# EAGLE design ftduino (EAGLE 7.5.0)
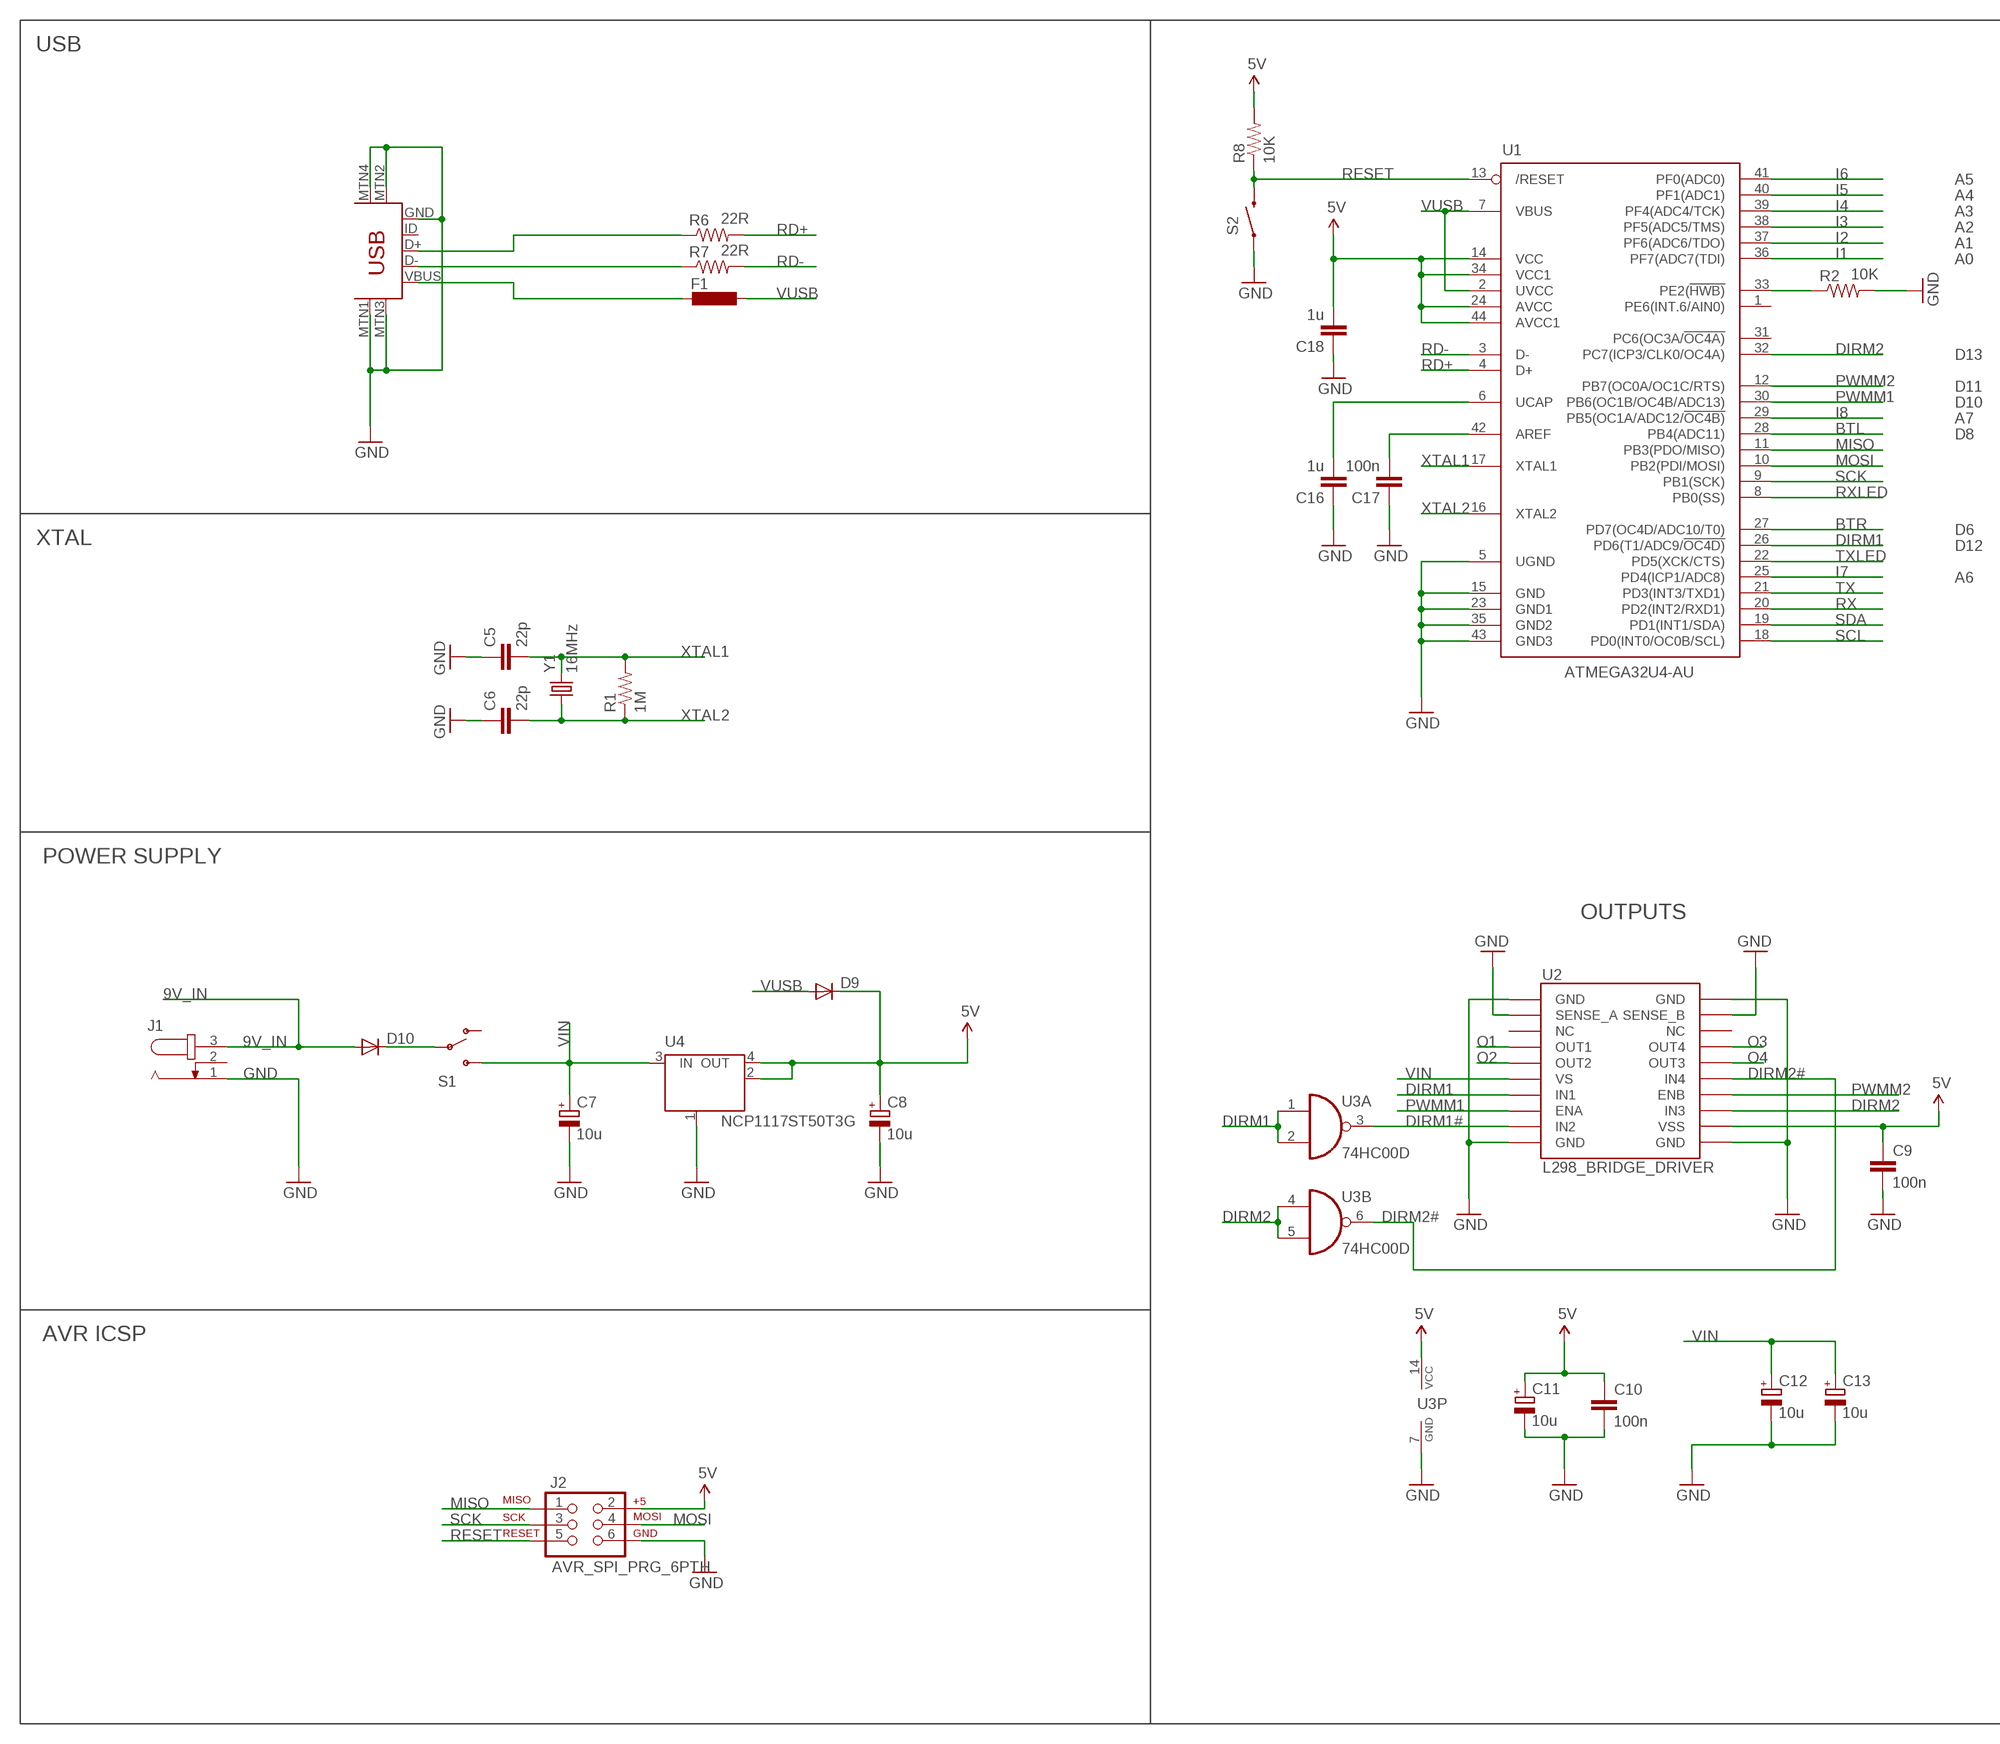
[diagram p0: schematic, sheet 1, part 1 of 2]
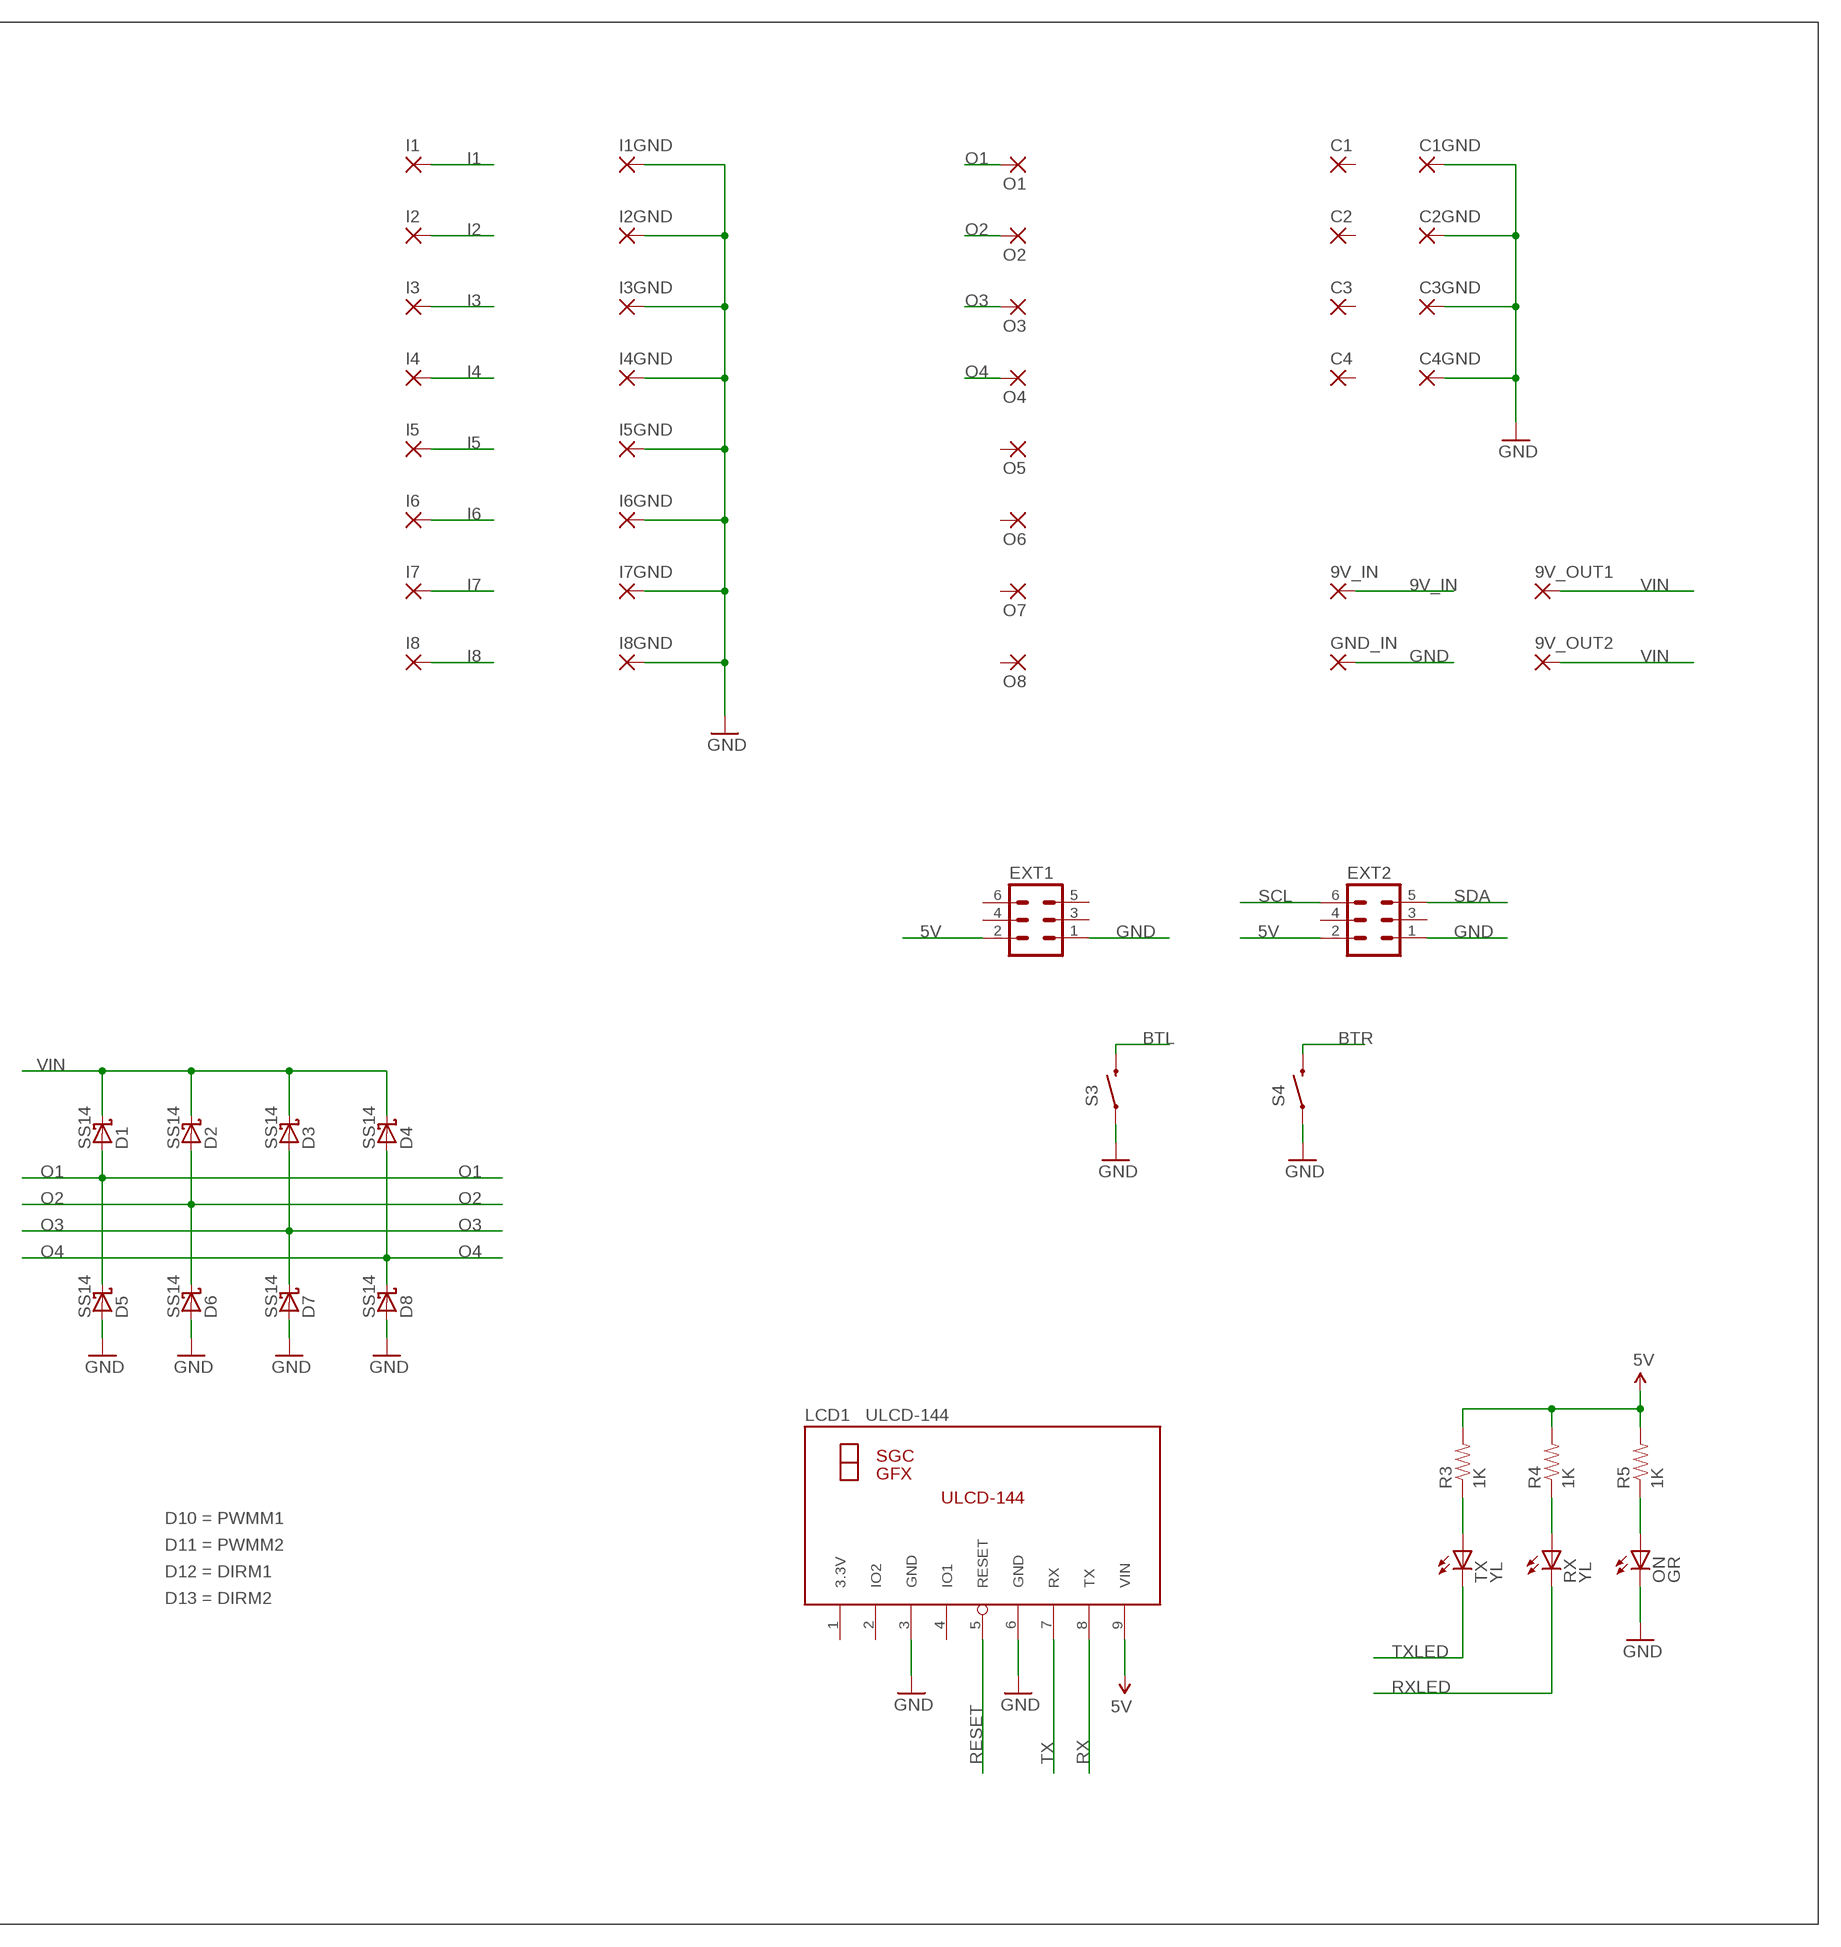
[diagram p1: schematic, sheet 1, part 2 of 2]

## Parts
9V_IN  5,0/3,2  [5,0/3,2]
9V_OUT1  5,0/3,2  [5,0/3,2]
9V_OUT2  5,0/3,2  [5,0/3,2]
C1  5,0/3,2  [5,0/3,2]
C1GND  5,0/3,2  [5,0/3,2]
C2  5,0/3,2  [5,0/3,2]
C2GND  5,0/3,2  [5,0/3,2]
C3  5,0/3,2  [5,0/3,2]
C3GND  5,0/3,2  [5,0/3,2]
C4  5,0/3,2  [5,0/3,2]
C4GND  5,0/3,2  [5,0/3,2]
C5  22p  CAP0603-CAP  [0603-CAP]
C6  22p  CAP0603-CAP  [0603-CAP]
C7  10u  CPOL-EUSMCB  [SMC_B]
C8  10u  CPOL-EUSMCB  [SMC_B]
C9  100n  CAP0603-CAP  [0603-CAP]
C10  100n  CAP0603-CAP  [0603-CAP]
C11  10u  CPOL-EUSMCB  [SMC_B]
C12  10u  CPOL-EUSMCB  [SMC_B]
C13  10u  CPOL-EUSMCB  [SMC_B]
C16  1u  CAP0603-CAP  [0603-CAP]
C17  100n  CAP0603-CAP  [0603-CAP]
C18  1u  CAP0603-CAP  [0603-CAP]
D1  SS14  SCHOTTKY-DIODE  [SMA]
D2  SS14  SCHOTTKY-DIODE  [SMA]
D3  SS14  SCHOTTKY-DIODE  [SMA]
D4  SS14  SCHOTTKY-DIODE  [SMA]
D5  SS14  SCHOTTKY-DIODE  [SMA]
D6  SS14  SCHOTTKY-DIODE  [SMA]
D7  SS14  SCHOTTKY-DIODE  [SMA]
D8  SS14  SCHOTTKY-DIODE  [SMA]
D9  DIODE-SMB  [SMB]
D10  DIODE-SMB  [SMB]
EXT1  MA03-2  [MA03-2]
EXT2  MA03-2  [MA03-2]
F1  L-EUL1812  [L1812]
GND_IN  5,0/3,2  [5,0/3,2]
I1  5,0/3,2  [5,0/3,2]
I1GND  5,0/3,2  [5,0/3,2]
I2  5,0/3,2  [5,0/3,2]
I2GND  5,0/3,2  [5,0/3,2]
I3  5,0/3,2  [5,0/3,2]
I3GND  5,0/3,2  [5,0/3,2]
I4  5,0/3,2  [5,0/3,2]
I4GND  5,0/3,2  [5,0/3,2]
I5  5,0/3,2  [5,0/3,2]
I5GND  5,0/3,2  [5,0/3,2]
I6  5,0/3,2  [5,0/3,2]
I6GND  5,0/3,2  [5,0/3,2]
I7  5,0/3,2  [5,0/3,2]
I7GND  5,0/3,2  [5,0/3,2]
I8  5,0/3,2  [5,0/3,2]
I8GND  5,0/3,2  [5,0/3,2]
J1  JACK-PLUG1  [JK3.5/1.8]
J2  AVR_SPI_PRG_6PTH  [2X3]
LCD1  ULCD-144  [ULCD-144]
O1  5,0/3,2  [5,0/3,2]
O2  5,0/3,2  [5,0/3,2]
O3  5,0/3,2  [5,0/3,2]
O4  5,0/3,2  [5,0/3,2]
O5  5,0/3,2  [5,0/3,2]
O6  5,0/3,2  [5,0/3,2]
O7  5,0/3,2  [5,0/3,2]
O8  5,0/3,2  [5,0/3,2]
ON  GR  LEDCHIPLED_0805  [CHIPLED_0805]
R1  1M  RESISTOR0603-RES  [0603-RES]
R2  10K  RESISTOR0603-RES  [0603-RES]
R3  1K  RESISTOR0603-RES  [0603-RES]
R4  1K  RESISTOR0603-RES  [0603-RES]
R5  1K  RESISTOR0603-RES  [0603-RES]
R6  22R  RESISTOR0603-RES  [0603-RES]
R7  22R  RESISTOR0603-RES  [0603-RES]
R8  10K  RESISTOR0603-RES  [0603-RES]
RX  YL  LEDCHIPLED_0805  [CHIPLED_0805]
S1  SWITCH-SPSTPTH  [SWITCH-SPDT]
S2  SWITCH-MOMENTARY-2PTH  [TACTILE-PTH]
S3  SWITCH-MOMENTARY-2PTH  [TACTILE-PTH]
S4  SWITCH-MOMENTARY-2PTH  [TACTILE-PTH]
TX  YL  LEDCHIPLED_0805  [CHIPLED_0805]
U1  ATMEGA32U4-AU  [TQFP44]
U2  L298_BRIDGE_DRIVER  [POWERSO20]
U3  74HC00D  [SO14]
U4  NCP1117ST50T3G  MC33269ST-3.3T3  [SOT223]
X1  USB-MINIB-5PIN  [USB-MINIB]
Y1  16MHz  CRYSTALCTS406  [CTS406]

## Nets
5V: C8.+ C9.1 C10.1 C11.+ C18.2 D9.C EXT1.2 EXT2.2 J2.2 LCD1.9(VIN) R3.2 R4.2 R5.2 R8.2 U1.14(VCC) U1.24(AVCC) U1.34(VCC1) U1.44(AVCC1) U2.12(VSS) U3.14(P:VCC) U4.2(OUT) U4.4(OUT)
9V_IN: 9V_IN.1(P) D10.A J1.3
BTL: S3.3 U1.28(PB4(ADC11))
BTR: S4.3 U1.27(PD7(OC4D/ADC10/T0))
DIRM1: U1.26(PD6(T1/ADC9/!OC4D)) U2.7(IN1) U3.1(A:I0) U3.2(A:I1)
DIRM1#: U2.9(IN2) U3.3(A:O)
DIRM2: U1.32(PC7(ICP3/CLK0/OC4A)) U2.13(IN3) U3.4(B:I0) U3.5(B:I1)
DIRM2#: U2.15(IN4) U3.6(B:O)
GND: C1GND.1(P) C2GND.1(P) C3GND.1(P) C4GND.1(P) C5.1 C6.1 C7.- C8.- C9.2 C10.2 C11.- C12.- C13.- C16.1 C17.1 C18.1 D5.A D6.A D7.A D8.A EXT1.1 EXT2.1 GND_IN.1(P) I1GND.1(P) I2GND.1(P) I3GND.1(P) I4GND.1(P) I5GND.1(P) I6GND.1(P) I7GND.1(P) I8GND.1(P) J1.1 J2.6 LCD1.3(GND) LCD1.6(GND) ON.C R2.2 S2.1 S3.1 S4.1 U1.5(UGND) U1.15(GND) U1.23(GND1) U1.35(GND2) U1.43(GND3) U2.1(GND) U2.2(SENSE_A) U2.10(GND) U2.11(GND) U2.19(SENSE_B) U2.20(GND) U3.7(P:GND) U4.1(GND/ADJ) X1.GND X1.MTN1(MTN2) X1.MTN2(MTN3) X1.MTN3(MTN1) X1.MTN4
I1: I1.1(P) U1.36(PF7(ADC7(TDI))
I2: I2.1(P) U1.37(PF6(ADC6/TDO))
I3: I3.1(P) U1.38(PF5(ADC5/TMS))
I4: I4.1(P) U1.39(PF4(ADC4/TCK))
I5: I5.1(P) U1.40(PF1(ADC1))
I6: I6.1(P) U1.41(PF0(ADC0))
I7: I7.1(P) U1.25(PD4(ICP1/ADC8))
I8: I8.1(P) U1.29(PB5(OC1A/ADC12/!OC4B))
MISO: J2.1 U1.11(PB3(PDO/MISO))
MOSI: J2.4 U1.10(PB2(PDI/MOSI))
N$1: C17.2 U1.42(AREF)
N$2: C16.2 U1.6(UCAP)
N$3: R3.1 TX.A
N$4: R4.1 RX.A
N$5: ON.A R5.1
N$6: R6.1 X1.D+
N$7: R7.1 X1.D-
N$8: R2.1 U1.33(PE2(!HWB))
N$9: F1.2 X1.VBUS
N$12: D10.C S1.2(P)
O1: D1.A D5.C O1.1(P) U2.4(OUT1)
O2: D2.A D6.C O2.1(P) U2.5(OUT2)
O3: D3.A D7.C O3.1(P) U2.17(OUT4)
O4: D4.A D8.C O4.1(P) U2.16(OUT3)
PWMM1: U1.30(PB6(OC1B/OC4B/ADC13)) U2.8(ENA)
PWMM2: U1.12(PB7(OC0A/OC1C/RTS)) U2.14(ENB)
RD+: R6.2 U1.4(D+)
RD-: R7.2 U1.3(D-)
RESET: J2.5 LCD1.5(RESET) R8.1 S2.3 U1.13(/RESET)
RX: LCD1.8(TX) U1.20(PD2(INT2/RXD1))
RXLED: RX.C U1.8(PB0(SS))
SCK: J2.3 U1.9(PB1(SCK))
SCL: EXT2.6 U1.18(PD0(INT0/OC0B/SCL))
SDA: EXT2.5 U1.19(PD1(INT1/SDA))
TX: LCD1.7(RX) U1.21(PD3(INT3/TXD1))
TXLED: TX.C U1.22(PD5(XCK/CTS))
VIN: 9V_OUT1.1(P) 9V_OUT2.1(P) C7.+ C12.+ C13.+ D1.C D2.C D3.C D4.C S1.3(S) U2.6(VS) U4.3(IN)
VUSB: D9.A F1.1 U1.2(UVCC) U1.7(VBUS)
XTAL1: C5.2 R1.2 U1.17(XTAL1) Y1.3
XTAL2: C6.2 R1.1 U1.16(XTAL2) Y1.1
Unconnected: C1.1(P) C2.1(P) C3.1(P) C4.1(P) EXT1.3 EXT1.4 EXT1.5 EXT1.6 EXT2.3 EXT2.4 J1.2 LCD1.2(IO2) LCD1.4(IO1) O5.1(P) O6.1(P) O7.1(P) O8.1(P) S1.1(O) U1.1(PE6(INT.6/AIN0)) U1.31(PC6(OC3A/!OC4A)) U2.3(NC) U2.18(NC) U3.8(C:O) U3.9(C:I0) U3.10(C:I1) U3.11(D:O) U3.12(D:I0) U3.13(D:I1) X1.ID

## Notes on the sheet
- USB
- A5
- A4
- A3
- A2
- A1
- A0
- D13
- D11
- D10
- A7
- D8
- D6
- XTAL | D12
- A6
- POWER SUPPLY
- OUTPUTS
- AVR ICSP
- D10 = PWMM1
- D11 = PWMM2
- D12 = DIRM1
- D13 = DIRM2

## Power pins joined to a net without a drawn wire
3.3V: LCD1.1(3.3V)

## Library data of the parts
9V_IN 9V_OUT1 9V_OUT2 C1 C1GND C2 C2GND C3 C3GND C4 C4GND GND_IN I1 I1GND I2 I2GND I3 I3GND I4 I4GND I5 I5GND I6 I6GND I7 I7GND I8 I8GND O1-O8 = pacpac:5,0/3,2: THROUGH-HOLE PAD
C5 C6 C9 C10 C16-C18 = SparkFun:CAP: Capacitor Standard 0603 ceramic capacitor, and 0.1" leaded capacitor.
C7 C8 C11-C13 = rcl:CPOL-EU: POLARIZED CAPACITOR, European symbol
D1-D8 = pacpac:SCHOTTKY-DIODE: Schottky Diode
D9 D10 = diode:DIODE-: DIODE
EXT1 EXT2 = con-lstb:MA03-2: PIN HEADER; OC_FARNELL: unknown; OC_NEWARK: unknown
F1 = rcl:L-EU: INDUCTOR, European symbol
J1 = pacpac:JACK-PLUG: DC POWER JACK Power Jack, DC, Right Angle, Through Hole, Rated 5A at 16VDC, PC Terminals Distributor: Farnell (www.Farnell.de) Drawing: 84N1161.pdf / 84N1162.pdf Manufacturer: SPC Technology (www.spctechnology.com) Type: SPC4077 / SPC 4078; OC_FARNELL: unknown; OC_NEWARK: unknown
J2 = SparkFun:AVR_SPI_PRG_6: AVR ISP 6 Pin This is the reduced ISP connector for AVR programming. Common on Arduino. This footprint will take up less PCB space and can be used with a 10-pin to 6-pin adapter such as SKU: BOB-08508
LCD1 = pacpac:ULCD-144
ON RX TX = led:LED: LED OSRAM: - CHIPLED LG R971, LG N971, LY N971, LG Q971, LY Q971, LO R971, LY R971 LH N974, LH R974 LS Q976, LO Q976, LY Q976 LO Q996 - Hyper CHIPLED LW Q18S LB Q993, LB Q99A, LB R99A - SideLED LS A670, LO A670, LY A670, LG A670, LP A670 LB A673, LV A673, LT A673, LW A673 LH A674 LY A675 LS A676, LA A676, LO A676, LY A676, LW A676 LS A679, LY A679, LG A679 - Hyper Micro SIDELED® LS Y876, LA Y876, LO Y876, LY Y876 LT Y87S - SmartLED LW L88C, LW L88S LB L89C, LB L89S, LG L890 LS L89K, LO L89K, LY L89K LS L896, LA L896, LO L896, LY L896 - TOPLED LS T670, LO T670, LY T670, LG T670, LP T670 LSG T670, LSP T670, LSY T670, LOP T670, LYG T670 LG T671, LOG T671, LSG T671 LB T673, LV T673, LT T673, LW T673 LH T674 LS T676, LA T676, LO T676, LY T676, LB T676, LH T676, LSB T676, LW T676 LB T67C, LV T67C, LT T67C, LS T67K, LO T67K, LY T67K, LW E67C LS E67B, LA E67B, LO E67B, LY E67B, LB E67C, LV E67C, LT E67C LW T67C LS T679, LY T679, LG T679 LS T770, LO T770, LY T770, LG T770, LP T770 LB T773, LV T773, LT T773, LW T773 LH T774 LS E675, LA E675, LY E675, LS T675 LS T776, LA T776, LO T776, LY T776, LB T776 LHGB T686 LT T68C, LB T68C - Hyper Mini TOPLED® LB M676 - Mini TOPLED Santana® LG M470 LS M47K, LO M47K, LY M47K Source: http://www.osram.convergy.de LUXEON: - LUMILED® LXK2-PW12-R00, LXK2-PW12-S00, LXK2-PW14-U00, LXK2-PW14-V00 LXK2-PM12-R00, LXK2-PM12-S00, LXK2-PM14-U00 LXK2-PE12-Q00, LXK2-PE12-R00, LXK2-PE12-S00, LXK2-PE14-T00, LXK2-PE14-U00 LXK2-PB12-K00, LXK2-PB12-L00, LXK2-PB12-M00, LXK2-PB14-N00, LXK2-PB14-P00, LXK2-PB14-Q00 LXK2-PR12-L00, LXK2-PR12-M00, LXK2-PR14-Q00, LXK2-PR14-R00 LXK2-PD12-Q00, LXK2-PD12-R00, LXK2-PD12-S00 LXK2-PH12-R00, LXK2-PH12-S00 LXK2-PL12-P00, LXK2-PL12-Q00, LXK2-PL12-R00 Source: www.luxeon.com KINGBRIGHT: KA-3528ASYC Source: www.kingbright.com
R1-R8 = SparkFun:RESISTOR: Resistor Basic schematic elements and footprints for 0603, 1206, and PTH resistors.
S1 = SparkFun:SWITCH-SPST: SPST Switch Simple slide switch. Spark Fun Electronics SKU : COM-00102
S2-S4 = SparkFun:SWITCH-MOMENTARY-2
U1 = adafruit:ATMEGA32U4: http://www.ladyada.net/library/eagle
U2 = SparkFun:L298_BRIDGE_DRIVER
U3 = 74xx-eu:74*00: Quad 2-input NAND gate
U4 = linear:MC33269ST*: Adjustable Output Low Dropout Voltage Regulator 800 mA Source: http://www.onsemi.com/pub/Collateral/MC33269-D.PDF
X1 = SparkFun:USB-MINIB: Mini-USB "B" connector with 5th pin broken out. Created new symbol breaking out 5th "ID" pin in mini/micro USB connector spec. See: http://en.wikipedia.org/wiki/Mini_usb#Cables. Uses same footprint as 4-pin symbol. Also added pins to connect to mounting / shield pads if required (probably not generally needed as signals aren't shielded once they leave the connector).
Y1 = crystal:CRYSTAL: CRYSTAL; OC_FARNELL: unknown; OC_NEWARK: unknown

## Board
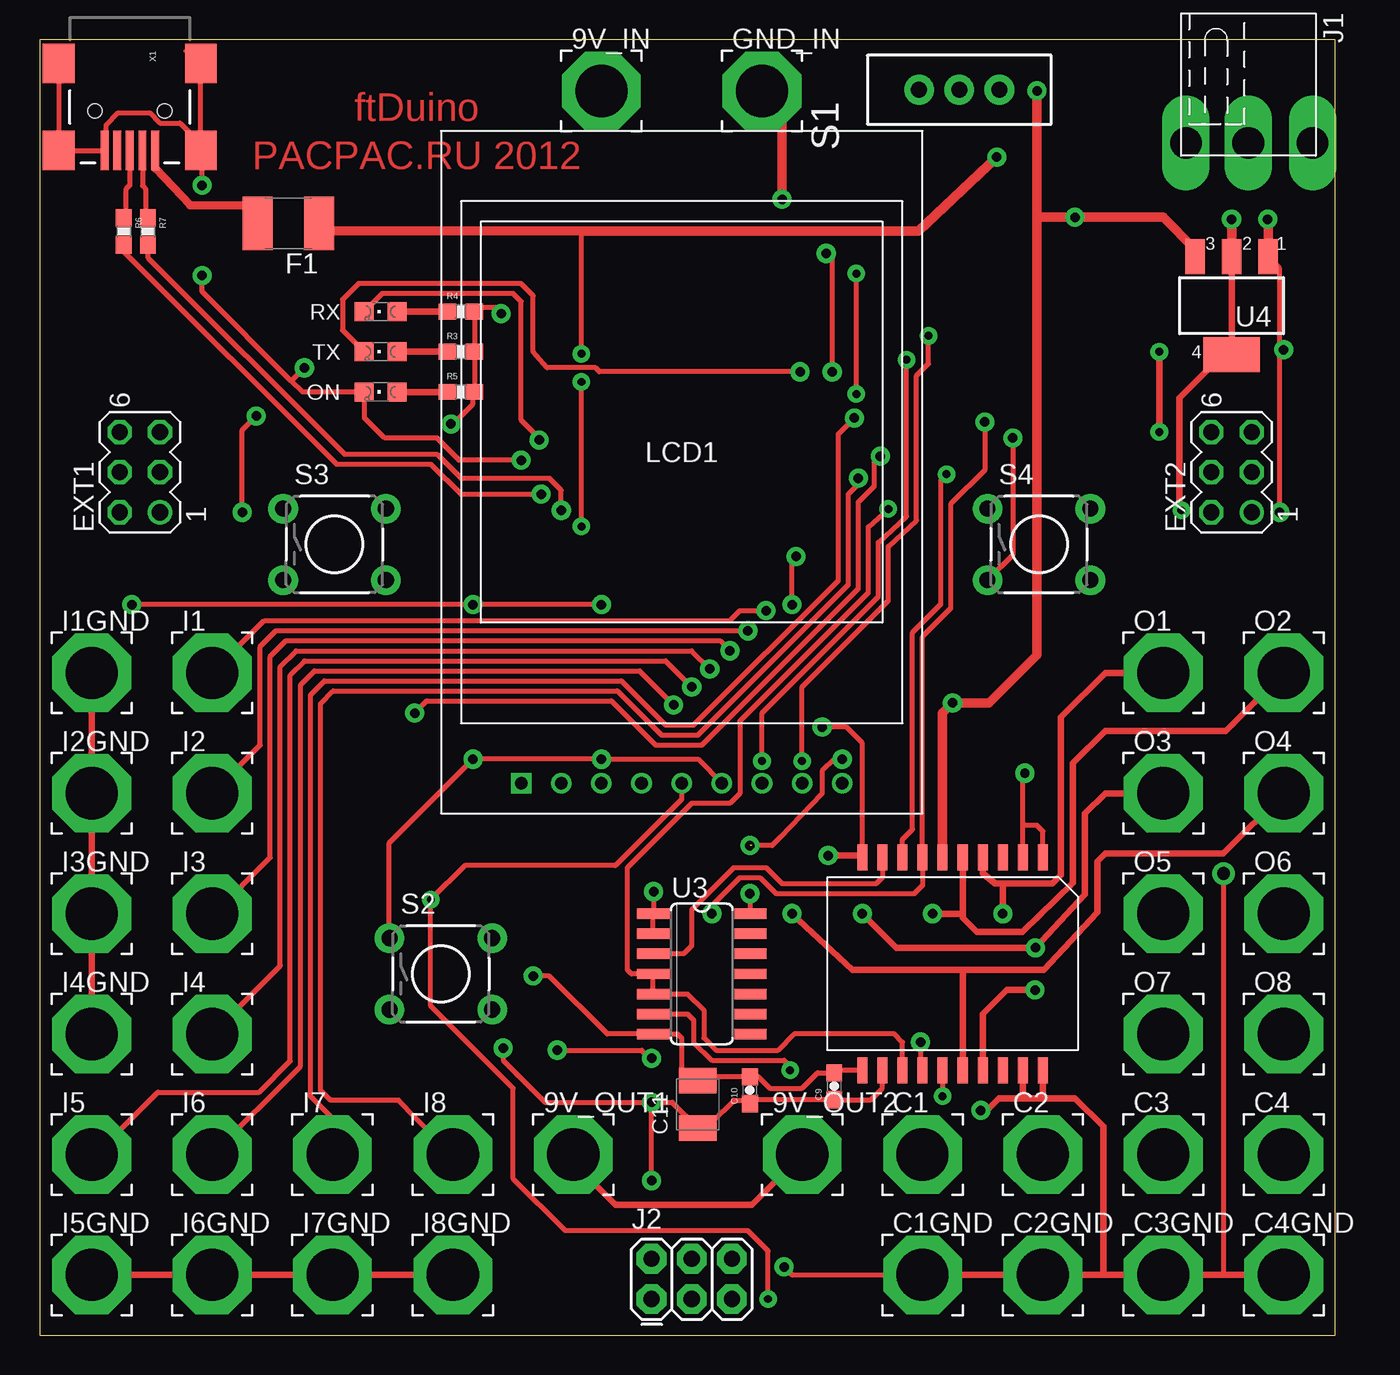
[diagram p2: board, top side]
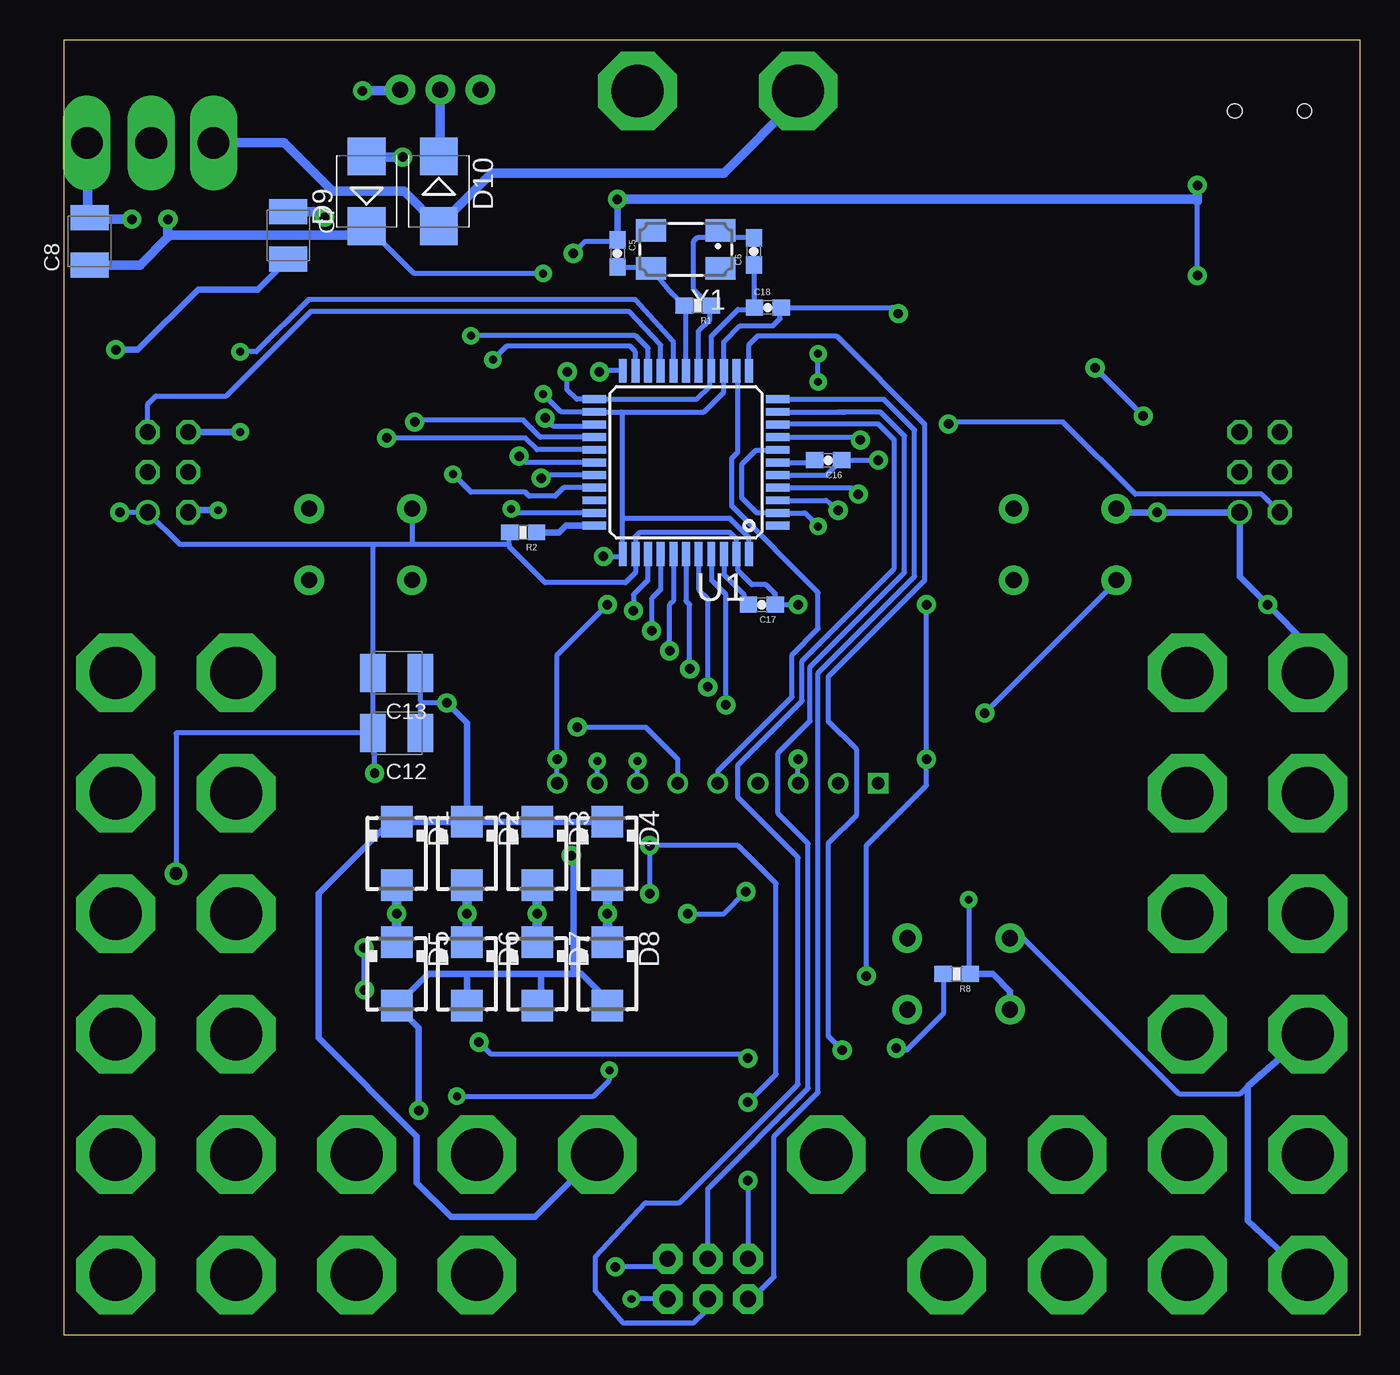
[diagram p3: board, bottom side, seen from below]

Size 81.99 x 81.99 mm. Coordinates in mm from the lower left corner, seen from the top.
Outline: 0,0 81.99,0 81.99,81.99 0,81.99 0,0
Copper layers (1*16): Top 0.035mm / dielectric 1.5mm / Bottom 0.035mm
Design rules "default": minimum track width 12mil, minimum drill 32mil, track to track 10mil, track to pad 10mil, pad to pad 10mil, via to via 10mil, smd to smd 8mil, copper to edge 40mil, drill to drill 40mil, minimum pad ring 10mil, minimum via ring 12mil, stop-mask expansion 4mil, vias tented up to drill 0mil, thermal gap 10mil

### Footprints (pad centres in the part's own frame; a part is rotated, then mirrored left to right if it is on the bottom)
5,0/3,2 = drill 3.302 pad 4.978 octagon: 1 0,0
0603-CAP = smd 1.1 x 1: 1 -0.85,0; 2 0.85,0
SMC_B = smd 1.6 x 2.4: + -1.5,0; - 1.5,0
SMA = smd 2 x 2: A 2,0; C -2,0
SMB = smd 2.4 x 2.4: A 2.2,0; C -2.2,0
MA03-2 = drill 1.016: 1 -2.54,-1.27 | drill 1.016 octagon: 2 -2.54,1.27; 3 0,-1.27; 4 0,1.27; 5 2.54,-1.27; 6 2.54,1.27
L1812 = smd 1.9 x 3.4: 1 -1.95,0; 2 1.95,0
JK3.5/1.8 = drill 2 pad 2.54 long: 1 -0.01,4.11; 2 -0.01,0.04; 3 -0.01,-3.906
2X3 = drill 1.016 pad 1.88 octagon: 1 0,0; 2 0,2.54; 3 2.54,0; 4 2.54,2.54; 5 5.08,0; 6 5.08,2.54
ULCD-144 = drill 0.8 square: 1 -10.16,-0.635 | drill 0.8: 2 -7.62,-0.635; 3 -5.08,-0.635; 4 -2.54,-0.635; 5 0,-0.635; 6 2.54,-0.635; 7 5.08,-0.635; 8 7.62,-0.635; 9 10.16,-0.635
CHIPLED_0805 = smd 1.2 x 1.2: A 0,-1.05; C 0,1.05
0603-RES = smd 1.1 x 1: 1 -0.85,0; 2 0.85,0
SWITCH-SPDT = drill 1.016 pad 1.88: 1 0,2.54; 2 0,0; 3 0,-2.54
TACTILE-PTH = drill 1.016 pad 1.88: 1 -3.251,2.261; 2 3.251,2.261; 3 -3.251,-2.261; 4 3.251,-2.261
TQFP44 = smd 1.5 x 0.5: 1 -5.8,4; 2 -5.8,3.2; 3 -5.8,2.4; 4 -5.8,1.6; 5 -5.8,0.8; 6 -5.8,0; 7 -5.8,-0.8; 8 -5.8,-1.6; 9 -5.8,-2.4; 10 -5.8,-3.2; 11 -5.8,-4; 23 5.8,-4; 24 5.8,-3.2; 25 5.8,-2.4; 26 5.8,-1.6; 27 5.8,-0.8; 28 5.8,0; 29 5.8,0.8; 30 5.8,1.6; 31 5.8,2.4; 32 5.8,3.2; 33 5.8,4 | smd 0.5 x 1.5: 12 -4,-5.8; 13 -3.2,-5.8; 14 -2.4,-5.8; 15 -1.6,-5.8; 16 -0.8,-5.8; 17 0,-5.8; 18 0.8,-5.8; 19 1.6,-5.8; 20 2.4,-5.8; 21 3.2,-5.8; 22 4,-5.8; 34 4,5.8; 35 3.2,5.8; 36 2.4,5.8; 37 1.6,5.8; 38 0.8,5.8; 39 0,5.8; 40 -0.8,5.8; 41 -1.6,5.8; 42 -2.4,5.8; 43 -3.2,5.8; 44 -4,5.8
POWERSO20 = smd 1.651 x 0.635: 1 -6.731,5.715; 2 -6.731,4.445; 3 -6.731,3.175; 4 -6.731,1.905; 5 -6.731,0.635; 6 -6.731,-0.635; 7 -6.731,-1.905; 8 -6.731,-3.175; 9 -6.731,-4.445; 10 -6.731,-5.715; 11 6.731,-5.715; 12 6.731,-4.445; 13 6.731,-3.175; 14 6.731,-1.905; 15 6.731,-0.635; 16 6.731,0.635; 17 6.731,1.905; 18 6.731,3.175; 19 6.731,4.445; 20 6.731,5.715
SO14 = smd 0.66 x 2.032: 1 -3.81,-3.073; 2 -2.54,-3.073; 3 -1.27,-3.073; 4 0,-3.073; 5 1.27,-3.073; 6 2.54,-3.073; 7 3.81,-3.073; 8 3.81,3.073; 9 2.54,3.073; 10 1.27,3.073; 11 0,3.073; 12 -1.27,3.073; 13 -2.54,3.073; 14 -3.81,3.073
SOT223 = smd 1.219 x 2.235: 1 -2.311,-3.099; 2 0,-3.099; 3 2.311,-3.099 | smd 3.6 x 2.2: 4 0,3.099
USB-MINIB = smd 2.5 x 0.5: D+ 2.5,0; D- 2.5,0.8; GND 2.5,-1.6; ID 2.5,-0.8; VBUS 2.5,1.6 | smd 2.5 x 2: MTN1 -3,4.5; MTN2 2.5,4.5; MTN3 -3,-4.5; MTN4 2.5,-4.5 | hole 0.9: 0,2.2; 0,-2.2
CTS406 = smd 1.9 x 1.4: 1 -2.2,-1.2; 2 2.2,-1.2; 3 2.2,1.2; 4 -2.2,1.2

### Placement (x,y rotation side)
9V_IN  35.56,78.74 0 top
9V_OUT1  33.78,11.43 0 top
9V_OUT2  48.26,11.43 0 top
C1  55.88,11.43 0 top
C1GND  55.88,3.81 0 top
C2  63.5,11.43 0 top
C2GND  63.5,3.81 0 top
C3  71.12,11.43 0 top
C3GND  71.12,3.81 0 top
C4  78.74,11.43 0 top
C4GND  78.74,3.81 0 top
C5  46.99,68.45 270 bottom
C6  38.35,68.58 90 bottom
C7  67.82,69.6 270 bottom
C8  80.39,69.22 90 bottom
C9  50.29,15.75 90 top
C10  44.96,15.49 90 top
C11  41.66,14.61 90 top
C12  60.96,38.1 180 bottom
C13  60.96,41.91 180 bottom
C16  33.66,55.37 180 bottom
C17  37.85,46.23 180 bottom
C18  37.47,65.02 0 bottom
D1  60.96,30.48 270 bottom
D2  56.52,30.48 270 bottom
D3  52.07,30.48 270 bottom
D4  47.62,30.48 270 bottom
D5  60.96,22.86 270 bottom
D6  56.52,22.86 270 bottom
D7  52.07,22.86 270 bottom
D8  47.62,22.86 270 bottom
D9  62.87,72.39 90 bottom
D10  58.29,72.39 270 bottom
EXT1  6.35,54.61 90 top
EXT2  75.44,54.61 90 top
F1  15.75,70.36 180 top
GND_IN  45.72,78.74 0 top
I1  10.92,41.91 0 top
I1GND  3.3,41.91 0 top
I2  10.92,34.29 0 top
I2GND  3.3,34.29 0 top
I3  10.92,26.67 0 top
I3GND  3.3,26.67 0 top
I4  10.92,19.05 0 top
I4GND  3.3,19.05 0 top
I5  3.3,11.43 0 top
I5GND  3.3,3.81 0 top
I6  10.92,11.43 0 top
I6GND  10.92,3.81 0 top
I7  18.54,11.43 0 top
I7GND  18.54,3.81 0 top
I8  26.16,11.43 0 top
I8GND  26.16,3.81 0 top
J1  76.45,75.44 270 top
J2  38.73,2.29 0 top
LCD1  40.64,35.56 0 top
O1  71.12,41.91 0 top
O2  78.74,41.91 0 top
O3  71.12,34.29 0 top
O4  78.74,34.29 0 top
O5  71.12,26.67 0 top
O6  78.74,26.67 0 top
O7  71.12,19.05 0 top
O8  78.74,19.05 0 top
ON  21.59,59.69 90 top
R1  41.91,65.15 180 bottom
R2  52.96,50.8 180 bottom
R3  26.67,62.23 0 top
R4  26.67,64.77 0 top
R5  26.67,59.69 0 top
R6  5.33,69.85 270 top
R7  6.86,69.85 270 top
R8  25.53,22.86 180 bottom
RX  21.59,64.77 90 top
S1  58.2,78.81 90 top
S2  25.4,22.86 0 top
S3  18.67,50.04 0 top
S4  63.25,50.04 0 top
TX  21.59,62.23 90 top
U1  42.65,55.23 180 bottom
U2  57.78,23.5 270 top
U3  41.91,22.86 270 top
U4  75.44,65.15 180 top
X1  5.71,77.47 270 top
Y1  42.67,68.71 180 bottom

### Tracks (layer width: path | path; a pad name or v marks a point on that pad's centre or on a via)
5V  (via drill 0.5, 0.6)  (1 unrouted)
  Top 0.305: C11.+ 41.76,12.8 | C11.+ 42.57,13.49 43.94,14.86 44.92,14.86 C10.1 | U2.12 53.34,15.62 52.62,14.9 C9.1 45.21,14.9 C10.1 | 45.21,14.73 45.12,14.64 C10.1 | v51.69,59.56 v51.69,67.18 | v29.34,18.16 29.34,17.4 32,14.73 v38.73,14.73 | v38.73,14.73 40.03,14.73 C11.+ | v38.73,9.78 v38.73,14.73 | v26.04,57.66 26.16,57.66 27.43,58.93 27.43,59.6 R5.2 R3.2 R4.2 27.77,65.02 28.96,65.02 v29.21,64.64 | v50.8,36.45 50.29,36.45 49.53,35.69 49.53,34.29 46.86,31.5 46.35,30.99 v44.96,30.99 | v44.96,27.94 44.96,26.7 U3.14 | v47.62,46.23 47.62,49.02 v47.88,49.28
  Top 0.406: 75.44,62.61 v75.44,70.61 | U4.4 75.44,62.61 | 75.44,62.61 72.14,59.31 72.14,52.32 v72.26,52.2
  Top 0.61: U4.2 v75.44,70.61
  Bottom 0.305: v38.73,9.78 J2.2 | v51.69,59.56 50.55,58.43 U1.24 46.74,58.43 | v51.69,67.18 59.86,67.18 D9.C | 46.74,58.43 41.52,58.43 40.26,59.69 U1.14 40.25,62.11 40.26,62.85 39.23,63.88 37.14,63.88 36.7,64.32 36.7,64.68 C18.2 29.59,65.02 v29.21,64.64 | 46.65,51.69 U1.34 46.8,49.28 v47.88,49.28 | 46.65,51.69 46.65,58.34 46.74,58.43 | R8.2 26.38,20.36 28.7,18.03 29.21,18.03 v29.34,18.16 | EXT1.2 6.22,53.21 14.22,53.21 18.8,57.78 25.91,57.78 v26.04,57.66 | LCD1.9 v50.8,36.45 50.8,43.05 v47.62,46.23 | v44.96,30.99 v44.96,27.94 | U1.44 38.65,50.47 39.88,51.69 46.65,51.69 | v38.73,14.73 36.96,16.51 36.96,28.57 39.37,30.99 45.09,30.99
  Bottom 0.406: v72.26,52.2 74.04,52.2 EXT2.2
  Bottom 0.61: D9.C 62.99,70.06 62.99,69.6 75.31,69.6 75.44,69.47 | C8.+ 77.19,67.72 75.44,69.47 | 75.44,69.47 v75.44,70.61
9V_IN
  Bottom 0.61: J1.3 68.08,75.45 65.02,72.39 60.49,72.39 D10.A 54.95,73.53 40.26,73.53 35.56,78.23 9V_IN.1
BTL  (via drill 0.6)
  Top 0.305: v23.75,39.37 24.51,40.13 36.2,40.13 38.99,37.34 41.91,37.34 51.82,47.24 51.82,52.7 52.83,53.72 52.83,55.24 v53.21,55.63
  Bottom 0.305: S3.3 15.42,47.7 v23.75,39.37 | 52.96,55.37 v53.21,55.63 52.81,55.23 U1.28
BTR  (via drill 0.6)
  Top 0.305: v61.59,56.77 61.59,49.38 S4.3
  Bottom 0.305: U1.27 52.09,56.03 52.83,56.77 v61.59,56.77
DIRM1  (via drill 0.6)
  Top 0.305: U3.2 U3.1 38.86,26.7 v38.86,28.07 | v59.82,57.78 59.82,54.74 57.66,52.58 57.66,45.97 55.88,44.2 U2.7 55.88,28.45 55.37,27.94 46.61,27.94 45.59,28.96 44.32,28.96 42.55,27.18 v42.55,26.67
  Bottom 0.305: U1.26 51.87,56.83 52.96,57.91 59.69,57.91 v59.82,57.78 | v42.55,26.67 40.26,26.67 v38.86,28.07
DIRM1#
  Top 0.305: U2.9 53.34,28.96 52.96,28.57 46.99,28.57 45.97,29.59 43.94,29.59 41.27,26.92 41.27,24.64 40.77,24.13 U3.3
DIRM2  (via drill 0.5)
  Top 0.305: v53.72,52.28 52.45,51.14 52.45,46.99 44.32,38.86 44.32,34.29 43.69,33.66 41.27,33.66 37.21,29.59 37.21,23.11 37.47,22.86 U3.4 U3.5 41.02,21.59 42.04,20.57 42.04,18.8 42.8,18.03 46.74,18.03 47.75,19.05 54.1,19.05 54.61,18.54 U2.13
  Bottom 0.305: U1.32 53.47,52.03 v53.72,52.28
DIRM2#  (via drill 0.5)
  Top 0.305: U3.6 41.02,20.32 41.4,19.94 41.4,18.54 42.55,17.4 47.12,17.4 47.5,17.02 v47.5,16.76 | U2.15 v57.15,15.11
  Bottom 0.305: v57.15,15.11 48.51,15.11 47.5,16.13 v47.5,16.76
GND  (via drill 0.6, 0.81)
  Top 0.305: C11.- 41.78,16.76 | C11.- 41.9,16.6 42.15,16.34 C10.2 45,16.38 45.47,16.38 46.23,15.62 48.26,15.62 49.24,16.6 C9.2 50.46,16.76 U2.11 | C11.- 41.51,16.26 40.77,16.26 40.64,16.38 40.64,18.8 40.39,19.05 U3.7 35.94,19.05 32.26,22.73 v31.24,22.73 | X1.MTN3 X1.MTN4 X1.GND 4.12,75.49 4.19,75.56 4.19,76.58 4.95,77.34 6.99,77.34 7.62,76.71 8.89,76.71 9.91,75.69 10.21,75.69 | 10.21,75.69 X1.MTN1 10.21,81.22 10.16,81.28 9.27,81.28 | 15.94,60.39 16.64,59.69 ON.C 20.57,59.66 20.57,58.04 21.84,56.77 25.15,56.77 26.54,55.37 v30.48,55.37 | 15.94,60.39 10.29,66.04 v10.29,67.06 | v10.29,72.77 10.29,74.9 X1.MTN2 10.21,75.69 | S2.1 22.1,25.17 22.1,31.11 v27.43,36.45 v35.56,36.45 41.66,36.45 LCD1.6 | v50.16,60.96 50.16,68.07 v49.78,68.45 | v12.83,52.07 12.83,57.28 v13.72,58.17 | v16.76,61.21 15.94,60.39 | v35.56,46.23 v27.43,46.23 5.97,46.23 5.91,46.29 | v78.49,52.07 78.49,62.36 78.49,67.51 U4.1 | U2.2 62.23,32.38 | 62.23,32.38 62.23,35.43 v62.36,35.56 | U2.1 63.5,31.88 63.12,32.26 62.36,32.26 62.23,32.38 | v47.12,4.32 47.62,3.81 C1GND.1 | 51.94,30.35 52.07,30.48 52.07,37.47 51.05,38.48 v49.53,38.48 | v74.93,29.21 74.93,3.81
  Top 0.406: I1GND.1 I2GND.1 I3GND.1 I4GND.1 | C2GND.1 C1GND.1 67.31,3.81 | 67.31,3.81 C3GND.1 74.93,3.81 C4GND.1 | I5GND.1 I6GND.1 I7GND.1 I8GND.1 | v78.74,62.36 78.49,62.36 | U2.20 63.5,15.24 63.25,14.99 | 63.25,14.99 62.48,14.99 | 62.48,14.99 62.23,15.24 U2.19 | 63.25,14.99 65.53,14.99 67.31,13.21 67.31,3.81 | 62.48,14.99 60.71,14.99 59.94,14.22 v59.56,14.22 | U2.10 51.94,30.35 v49.91,30.35
  Top 0.61: U4.1 77.75,70.59 v77.72,70.61 | v46.99,71.88 46.99,77.47 GND_IN.1
  Bottom 0.305: U1.5 33.75,54.43 C16.1 v30.48,55.37 | 53.85,50.04 53.85,50.76 R2.2 | 53.85,50.04 53.85,49.91 51.56,47.62 46.48,47.62 45.85,48.25 U1.35 45.85,50.55 45.59,50.8 39.88,50.8 39.45,50.38 U1.43 39.37,49.34 39.37,48.39 38.48,47.5 37.59,47.5 37,46.9 C17.1 v35.56,46.23 | 53.85,50.04 59.94,50.04 | 59.94,50.04 62.36,50.04 | 62.36,50.04 74.68,50.04 EXT2.1 v78.49,52.07 | S4.1 59.99,50.09 59.94,50.04 | C12.- C13.- 62.46,49.94 62.36,50.04 | C6.1 38.31,67.69 C18.1 38.44,64.9 39.37,64.9 41.05,63.21 U1.15 41.15,60.93 41.15,60.07 41.99,59.23 U1.23 49.58,59.23 50.16,59.82 v50.16,60.96 | v10.29,67.06 10.29,71.75 10.29,71.88 | LCD1.3 v35.56,36.45 | v49.78,68.45 49.02,69.22 47.08,69.22 C5.1 | v13.72,58.17 v16.76,61.21 | v62.36,35.56 62.36,38 C12.- | 27.56,46.23 27.43,46.1 v27.43,36.45 27.43,34.8 31.24,30.99 v31.24,22.73 | J2.6 44.32,4.32 v47.12,4.32 | v49.53,38.48 45.21,38.48 43.18,36.45 LCD1.6 | S2.1 21.59,25.4 11.43,15.24 7.62,15.24 6.35,16.51 6.3,16.45 | v74.93,29.21 74.93,38.1 C12.- | 62.23,38.1 C12.-
  Bottom 0.406: I5GND.1 3.43,3.81 7.11,7.24 7.11,15.75 6.3,16.45 I4GND.1 | I1GND.1 3.3,43.69 v5.84,46.23 7.62,48.01 EXT1.1 v12.83,52.07 15.19,52.07 S3.1 | C5.1 v46.99,71.88 | C7.- 69.75,66.17 73.53,66.17 77.34,62.36 v78.74,62.36 | 56.52,22.86 58.93,22.86 59.05,22.73 59.09,22.73 D5.A 60.96,20.83 59.56,19.43 v59.56,14.22 | 56.52,22.86 51.82,22.86 | 51.82,22.86 49.78,22.86 | 49.78,22.86 49.28,22.86 47.62,21.21 D8.A | D7.A 51.82,21.11 51.82,22.86 | D6.A 56.52,22.86 | v49.91,30.35 49.78,30.23 49.78,22.86
  Bottom 0.61: C8.- 80.52,70.61 | 80.52,70.61 80.52,75.4 J1.1 | v77.72,70.61 80.52,70.61 | v46.99,71.88 10.41,71.88 10.29,71.75 | v10.29,72.77 10.29,71.88
I1  (via drill 0.6)
  Top 0.305: I1.1 14.22,45.21 43.69,45.21 44.32,45.85 v45.97,45.85
  Bottom 0.305: U1.36 45.09,49.4 45.09,47.75 45.97,46.86 v45.97,45.85
I2  (via drill 0.6)
  Top 0.305: I2.1 13.97,37.34 13.97,43.59 14.96,44.58 v44.83,44.58
  Bottom 0.305: U1.37 44.25,47.19 44.83,46.61 v44.83,44.58
I3  (via drill 0.6)
  Top 0.305: I3.1 11.05,26.67 14.61,30.23 14.61,42.95 15.6,43.94 43.05,43.94 v43.69,43.31
  Bottom 0.305: U1.38 43.45,46.46 43.69,46.23 v43.69,43.31
I4  (via drill 0.6)
  Top 0.305: I4.1 15.24,23.37 15.24,42.31 16.23,43.31 41.27,43.31 v42.42,42.16
  Bottom 0.305: U1.39 42.65,46.46 42.42,46.23 v42.42,42.16
I5  (via drill 0.6)
  Top 0.305: I5.1 3.56,11.43 7.49,15.37 13.9,15.37 15.88,17.34 15.88,41.77 16.77,42.67 39.62,42.67 v41.27,41.02
  Bottom 0.305: U1.40 41.85,47.19 41.27,46.61 v41.27,41.02
I6  (via drill 0.6)
  Top 0.305: I6.1 16.51,17.02 16.51,41.14 17.41,42.04 37.97,42.04 v40.13,39.88
  Bottom 0.305: v40.13,39.88 40.13,46.86 41.01,47.74 41.01,49.38 U1.41
I7  (via drill 0.6)
  Top 0.305: I7.1 18.54,13.72 17.14,15.11 17.14,40.5 18.04,41.4 36.83,41.4 39.62,38.61 41.4,38.61 50.55,47.75 50.55,57.02 v51.56,58.04
  Bottom 0.305: v51.56,58.04 51.05,57.53 48.55,57.53 U1.25
I8  (via drill 0.6)
  Top 0.305: I8.1 26.04,11.43 22.73,14.86 18.41,14.86 17.78,15.49 17.78,39.95 18.59,40.77 36.58,40.77 39.37,37.97 41.66,37.97 51.18,47.5 51.18,53.21 51.82,53.85 v51.82,54.23
  Bottom 0.305: U1.29 51.62,54.43 v51.82,54.23
MISO
  Bottom 0.305: J2.1 38.48,2.29 37.08,3.68 37.08,12.57 34.29,15.37 34.29,41.91 28.19,48.01 28.19,57.28 30.14,59.23 U1.11
MOSI
  Bottom 0.305: J2.4 41.27,9.27 34.92,15.62 34.92,31.11 36.83,33.02 36.83,36.83 34.8,38.86 34.8,42.29 28.83,48.26 28.83,56.9 30.35,58.42 33.01,58.42 33.02,58.43 | U1.10 33.02,58.43 | 33.02,58.43 32.52,58.43
N$1
  Bottom 0.305: U1.42 40.25,48.13 38.99,46.86 38.99,46.52 C17.2
N$2
  Bottom 0.305: U1.6 34.65,55.23 C16.2
N$3
  Top 0.406: R3.1 TX.A
N$4
  Top 0.406: R4.1 RX.A
N$5
  Top 0.406: R5.1 ON.A
N$6
  Top 0.305: X1.D+ 5.71,72.77 5.46,72.52 5.46,70.83 R6.1
N$7
  Top 0.305: X1.D- 6.51,72.73 6.73,72.52 6.73,71.08 R7.1
N$8
  Bottom 0.406: U1.33 50.25,51.23 50.67,50.8 R2.1
N$9
  Top 0.406: X1.VBUS 7.32,73.84
  Top 0.508: 13.84,71.5 9.53,71.5 7.32,73.84
  Top 0.61: 13.84,71.63 13.84,71.5 13.84,70.4 F1.2
N$12
  Bottom 0.61: S1.2 58.2,74.68 D10.C
O1  (via drill 0.6)
  Top 0.305: D1.A 60.87,28.57 60.45,28.57 60.42,28.61
  Top 0.406: O1.1 67.44,41.91 64.64,39.12 64.64,29.11 64.1,28.57 60.45,28.57 | U2.4 59.69,29.21 60.42,28.61 | D1.A v60.96,26.67
  Bottom 0.61: D1.A v60.96,26.67 D5.C
O2  (via drill 0.6)
  Top 0.406: O2.1 75.06,38.23 67.44,38.23 65.41,36.2 65.41,28.62 62.19,25.53 59.31,25.53 58.42,26.42 58.42,26.67 | 58.42,26.67 U2.5 | v56.52,26.67 58.42,26.67
  Bottom 0.61: D2.A v56.52,26.67 D6.C
O3  (via drill 0.6)
  Top 0.406: O3.1 67.44,34.29 66.17,33.02 66.17,27.9 v63.03,24.51 54.23,24.51 v52.07,26.67 | U2.17 59.69,20.32 61.21,21.84 v62.99,21.84
  Bottom 0.406: v63.03,24.51 62.99,24.47 v62.99,21.84
  Bottom 0.61: D3.A v52.07,26.67 D7.C
O4  (via drill 0.6)
  Top 0.406: O4.1 74.93,30.48 67.44,30.48 66.93,29.97 66.93,26.75 63.55,23.11 58.42,23.11 | v47.62,26.67 51.44,23.11 58.42,23.11 | U2.16 58.42,23.11
  Bottom 0.61: D4.A v47.62,26.67 D8.C
PWMM1  (via drill 0.5)
  Top 0.305: U2.8 54.61,31.37 55.24,32 55.24,44.45 57.02,46.23 57.02,54.1 v57.4,54.48
  Bottom 0.305: U1.30 50.39,53.63 50.93,53.09 52.58,53.09 52.83,53.34 56.26,53.34 v57.4,54.48
PWMM2  (via drill 0.6)
  Top 0.305: v32.77,18.03 38.1,18.03 38.23,17.91 v38.73,17.53 | v55.75,18.54 55.75,16.89 U2.14
  Bottom 0.305: U1.12 38.65,62.69 38.1,63.25 33.15,63.25 27.56,57.66 27.56,47.75 33.66,41.66 33.66,38.86 31.88,37.08 31.88,32.89 33.66,31.11 33.66,18.92 v32.77,18.03 | v38.73,17.53 38.86,17.53 39.12,17.78 54.99,17.78 v55.75,18.54
RD+  (via drill 0.6)
  Top 0.305: R6.2 5.33,68.58 18.8,55.12 24.77,55.12 26.67,53.21 v31.75,53.21
  Bottom 0.305: U1.4 32.16,53.63 v31.75,53.21
RD-  (via drill 0.6)
  Top 0.305: R7.2 6.86,68.2 19.3,55.75 25.15,55.75 26.67,54.23 32.26,54.23 33.02,53.47 v33.02,52.2
  Bottom 0.305: U1.3 33.78,52.83 v33.02,52.2
RESET  (via drill 0.5)
  Top 0.305: LCD1.5 40.64,33.91 36.45,29.72 26.92,29.72 v24.77,27.56 24.77,20.83 29.97,15.62 29.97,9.91 33.27,6.6 44.83,6.6 46.1,5.33 v46.1,2.29
  Bottom 0.305: v24.77,27.56 24.77,22.95 R8.1 | J2.5 v46.1,2.29 | LCD1.5 40.64,35.69 35.94,40.39 35.94,43.05 34.29,44.7 34.29,46.99 39.75,52.45 39.75,55.5 39.37,55.88 39.37,60.94 U1.13
  Bottom 0.406: S2.3 22.15,21.77 23.24,22.86 R8.1
RX  (via drill 0.5)
  Top 0.305: v48.26,36.32 48.26,41.02 53.72,46.48 53.72,49.91 55.5,51.56 55.5,60.71 56.26,61.47 v56.26,63.25
  Bottom 0.305: U1.20 45.05,62.45 45.85,63.25 v56.26,63.25 | LCD1.8 v48.26,36.32
RXLED  (via drill 0.6)
  Top 0.305: v31.62,56.64 31.62,56.77 30.48,57.91 30.48,65.41 29.97,65.91 21.68,65.91 RX.C
  Bottom 0.305: U1.8 31.81,56.83 v31.62,56.64
SCK
  Bottom 0.305: U1.9 36.82,57.66 30.48,57.66 29.46,56.64 29.46,48.51 35.31,42.67 35.31,40.13 39.37,36.07 39.37,34.04 35.56,30.23 35.56,15.88 43.05,8.38 45.21,8.38 48.39,4.95 48.39,2.79 46.61,0.76 42.16,0.76 41.27,1.65 J2.3
SCL  (via drill 0.5)
  Top 0.406: v70.87,57.15 v70.87,62.23
  Bottom 0.305: U1.18 43.45,62.88 45.85,65.53 66.55,65.53 69.85,62.23 v70.87,62.23
  Bottom 0.406: EXT2.6 v70.87,57.15
SDA
  Bottom 0.305: U1.19 44.25,62.67 46.23,64.77 66.42,64.77 71.75,59.44 76.2,59.44 76.71,58.93 EXT2.5
TX  (via drill 0.5)
  Top 0.305: v45.72,36.32 45.72,39.37 53.09,46.74 53.09,50.16 54.86,51.82 v54.86,61.72
  Bottom 0.305: U1.21 45.85,62.23 46.23,62.61 53.98,62.61 v54.86,61.72 | LCD1.7 v45.72,36.32
TXLED  (via drill 0.6)
  Top 0.305: v48.13,60.96 35.43,60.96 35.18,61.21 32.13,61.21 31.24,62.23 31.24,65.78 30.47,66.55 20.19,66.55 19.18,65.53 19.18,63.59 TX.C
  Bottom 0.305: U1.22 48.07,61.03 v48.13,60.96
VIN  (via drill 0.6)
  Top 0.305: v63.12,78.74 63.5,78.74 63.25,78.61
  Top 0.406: 9V_OUT1.1 33.78,10.92 36.45,8.26 45.09,8.26 9V_OUT2.1
  Top 0.61: U2.6 57.15,39.37 v57.78,40.01 60.07,40.01 63.12,43.05 63.12,70.61 | 63.25,78.61 63.12,78.49 63.12,70.61 | U4.3 73.13,68.73 71.12,70.74 v65.53,70.74 63.25,70.74 63.12,70.61
  Bottom 0.305: v57.78,40.01 59.31,40.01 | 59.31,40.01 59.44,40.13 59.44,41.89 C13.+ | C12.+ 59.46,39.85 59.31,40.01
  Bottom 0.406: D4.C D3.C D2.C | D2.C D1.C 61.37,32.48 65.91,27.94 65.91,18.8 59.69,12.57 59.69,9.65 57.53,7.49 52.2,7.49 9V_OUT2.1 | D2.C 56.52,38.73 v57.78,40.01
  Bottom 0.61: v63.12,78.74 60.81,78.74 S1.3 | C7.+ 65.89,71.1 v65.53,70.74
VUSB  (via drill 0.5, 0.6)
  Top 0.305: v34.29,51.18 v34.29,60.33 | v34.29,62.1 34.29,69.85
  Top 0.406: 18.21,69.85 F1.1
  Top 0.559: 34.29,69.85 18.21,69.85
  Top 0.61: F1.1 17.7,70.91 | 34.29,69.85 55.63,69.85 v60.58,74.55
  Bottom 0.305: U1.7 36.87,56.01 38.23,56.01 39.12,55.12 39.12,52.98 38.16,52.03 U1.2 35.14,52.03 v34.29,51.18 | v34.29,60.33 v34.29,62.1
  Bottom 0.61: v60.58,74.55 62.82,74.55 D9.A
XTAL1
  Bottom 0.305: Y1.3 43.52,65.9 R1.2 42.65,65.05 U1.17 | 45.59,67.56 46.95,67.56
  Bottom 0.406: Y1.3 45.28,67.25 45.59,67.56 | 46.95,67.56 C5.2
XTAL2
  Bottom 0.305: U1.16 41.85,63.56 41.15,64.26 41.15,65.06 R1.1 41.82,65.83 42.16,66.17 42.16,69.22 41.91,69.47 40.66,69.47 | 40.26,69.47 38.39,69.47
  Bottom 0.406: 40.66,69.47 Y1.1 40.44,69.65 40.26,69.47 | 38.39,69.47 C6.2

### Text on the board
Top: ftDuino | PACPAC.RU 2012